# Altium schematic sheet Display.SchDoc
size A4
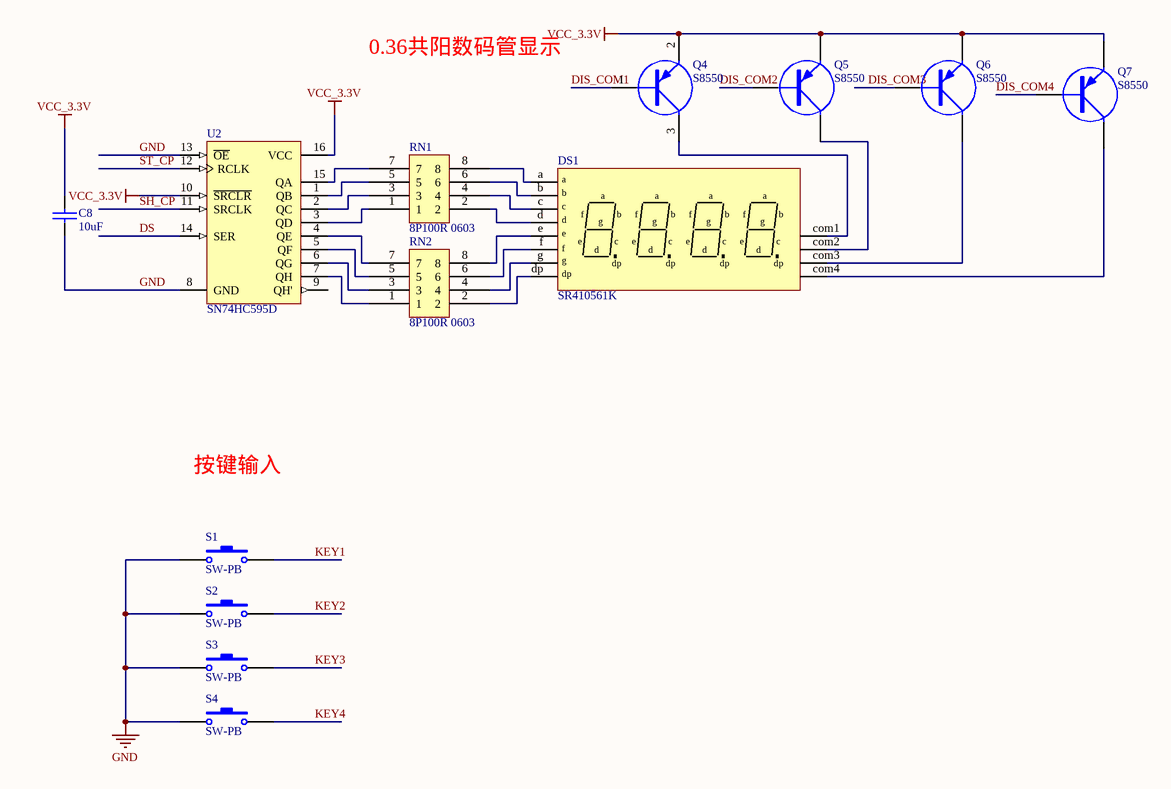
[diagram p0: Display.SchDoc]

## Parts
C8  10uF  [0805c]
DS1  SR410561K  [SR410361]
Q4  S8550  [SOT-23_B]
Q5  S8550  [SOT-23_B]
Q6  S8550  [SOT-23_B]
Q7  S8550  [SOT-23_B]
RN1  8P100R 0603  [8P4R_0603]
RN2  8P100R 0603  [8P4R_0603]
S1  SW-PB  [BUTTON_SMT_6*6]
S2  SW-PB  [BUTTON_SMT_6*6]
S3  SW-PB  [BUTTON_SMT_6*6]
S4  SW-PB  [BUTTON_SMT_6*6]
U2  SN74HC595D  [SO-16N]

## Nets
GND: C8.1 S1.1 S2.1 S3.1 S4.1 U2.8(GND) U2.13(~{OE})
VCC_3.3V: C8.2 Q4.2(E) Q5.2(E) Q6.2(E) Q7.2(E) U2.10(~{SRCLR}) U2.16(VCC)
DIS_COM1: Q4.1(B)
DIS_COM2: Q5.1(B)
DIS_COM3: Q6.1(B)
DIS_COM4: Q7.1(B)
DS: U2.14(SER)
KEY1: S1.2
KEY2: S2.2
KEY3: S3.2
KEY4: S4.2
SH_CP: U2.11(SRCLK)
ST_CP: U2.12(RCLK)
NetDS1_a: DS1.a RN1.8
NetDS1_b: DS1.b RN1.6
NetDS1_c: DS1.c RN1.4
NetDS1_com1: DS1.com1 Q4.3(C)
NetDS1_com2: DS1.com2 Q5.3(C)
NetDS1_com3: DS1.com3 Q6.3(C)
NetDS1_com4: DS1.com4 Q7.3(C)
NetDS1_d: DS1.d RN1.2
NetDS1_dp: DS1.dp RN2.2
NetDS1_e: DS1.e RN2.8
NetDS1_f: DS1.f RN2.6
NetDS1_g: DS1.g RN2.4
NetRN1_1: RN1.1 U2.3(QD)
NetRN1_3: RN1.3 U2.2(QC)
NetRN1_5: RN1.5 U2.1(QB)
NetRN1_7: RN1.7 U2.15(QA)
NetRN2_1: RN2.1 U2.7(QH)
NetRN2_3: RN2.3 U2.6(QG)
NetRN2_5: RN2.5 U2.5(QF)
NetRN2_7: RN2.7 U2.4(QE)

Not connected (* = marked no-connect by the designer): U2 9(QH')

## Notes on the sheet
- 0.36共阳数码管显示
- 按键输入

## Library data of the parts
C8 = CAP: Capacitor
DS1 = SR410561K: CP-SR410561K
Q4-Q7 = PNP: PNP Transistor
RN1 RN2 = 8P4R 0603
S1-S4 = SW-PB: Switch; Published: 24-Mar-1999; LatestRevisionDate: 17-Jul-2002; LatestRevisionNote: Re-released for DXP Platform.; PackageReference: SPST-2; Publisher: Altium Limited
U2 = SN74HC595D: 8-Bit Shift Register with 3-State Output Registers; Published: 8-Jun-2000; LatestRevisionDate: 13-Apr-2006; LatestRevisionNote: IPC-7351 Footprint Added.; DatasheetVersion: May-1997; PackageVersion: Jan-1998; PackageReference: D016; Publisher: Altium Limited; PackageDescription: 16-Pin Small Outline Integrated Circuit 1.27 mm Pitch; Code_IPC: SOIC127P600-16; ComponentLink1Description: Manufacturer Link; ComponentLink1URL: http://www.ti.com/; ComponentLink2Description: Datasheet; ComponentLink2URL: http://www-s.ti.com/sc/ds/sn74hc595.pdf